# EAGLE design PCB-BO-HIROSE12 (EAGLE 7.1.0)
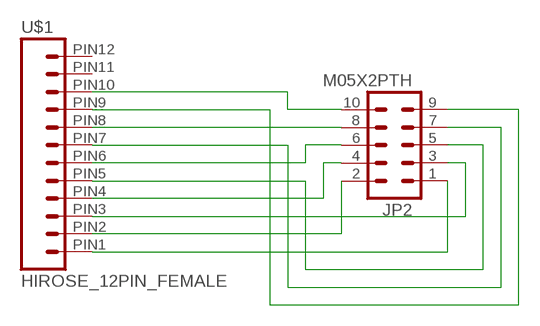
[diagram p0: schematic, sheet 1]

## Parts
JP2  M05X2PTH  [AVR_ICSP]
U$1  HIROSE_12PIN_FEMALE  [HIROSE_12PIN_RECEP]

## Nets
N$1: JP2.1 U$1.PIN1
N$2: JP2.2 U$1.PIN2
N$3 [power]: JP2.3 U$1.PIN3
N$4: JP2.4 U$1.PIN4
N$5: JP2.5 U$1.PIN5
N$6 [power]: JP2.6 U$1.PIN6
N$7: JP2.7 U$1.PIN7
N$8: JP2.8 U$1.PIN8
N$9: JP2.9 U$1.PIN9
N$10: JP2.10 U$1.PIN10
Unconnected: U$1.PIN11 U$1.PIN12

## Library data of the parts
JP2 = SKAARHOJ:M05X2: Header 5x2 Standard 10-pin dual row 0.1" header. Commonly used with AVR-ISP. Use with Spark Fun Electronics SKU: PRT-00778
U$1 = SKAARHOJ:HIROSE_12PIN_FEMALE

## Net classes
0 default: width 0.152 mm, clearance 0.152 mm
1 power: width 0.406 mm, clearance 0.152 mm

## Board
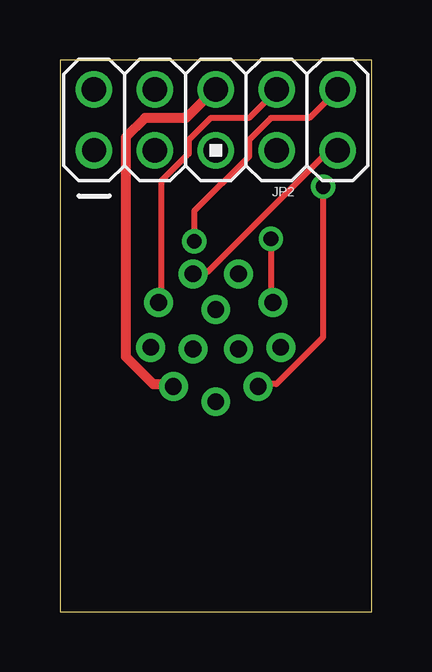
[diagram p1: board, top side]
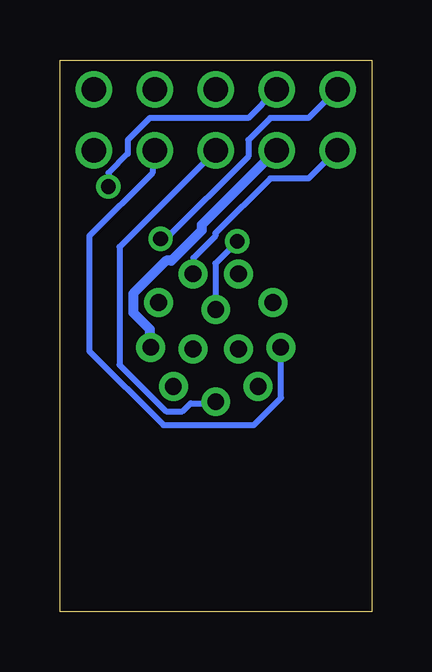
[diagram p2: board, bottom side, seen from below]

Size 13 x 23 mm. Coordinates in mm from the lower left corner, seen from the top.
Outline: 0,0 13,0 13,23 0,23 0,0
Copper layers (1*16): Top 0.035mm / dielectric 1.5mm / Bottom 0.035mm
Design rules "default": minimum track width 10mil, minimum drill 24mil, track to track 8mil, track to pad 8mil, pad to pad 8mil, via to via 8mil, smd to smd 8mil, copper to edge 40mil, drill to drill 8mil, minimum pad ring 10mil, minimum via ring 8mil, stop-mask expansion 4mil, vias tented up to drill 0mil, thermal gap 10mil

### Footprints (pad centres in the part's own frame; a part is rotated, then mirrored left to right if it is on the bottom)
AVR_ICSP = drill 1: 1 -1.27,5.08 | drill 1.016: 2 1.27,5.08; 3 -1.27,2.54; 4 1.27,2.54; 5 -1.27,0; 6 1.27,0; 7 -1.27,-2.54; 8 1.27,-2.54; 9 -1.27,-5.08; 10 1.27,-5.08
HIROSE_12PIN_RECEP = drill 0.7: PIN1 0.95,2.58; PIN2 2.38,1.38; PIN3 2.71,-0.48; PIN4 1.77,-2.11; PIN5 0,-2.75; PIN6 -1.77,-2.11; PIN7 -2.71,-0.48; PIN8 -2.38,1.38; PIN9 -0.95,2.58; PIN10 0,1.1; PIN11 0.95,-0.55; PIN12 -0.95,-0.55

### Placement (x,y rotation side)
JP2  6.5,20.5 90 top
U$1  6.5,11.5 0 top

### Tracks (layer width: path | path; a pad name or v marks a point on that pad's centre or on a via)
N$1
  Bottom 0.254: U$1.PIN1 7.43,14.17 7.43,14.74 6.51,15.66 6.51,15.77 4.23,18.06 2.63,18.06 1.49,19.2 JP2.1
N$2  (via drill 0.61)
  Top 0.254: v8.8,15.54 8.8,12.92 U$1.PIN2
  Bottom 0.254: v8.8,15.54 8.57,15.54 5.14,18.97 5.14,19.66 4.23,20.57 2.63,20.57 1.49,21.72 JP2.2
N$3
  Bottom 0.406: U$1.PIN3 9.26,11.09 9.26,11.77 9.94,12.46 9.94,13.26 8.57,14.63 8.34,14.63 7.09,15.89 7.09,16.12 4,19.2 JP2.3
N$4  (via drill 0.61)
  Top 0.254: v10.97,17.72 10.97,11.43 9.03,9.49 8.34,9.49 U$1.PIN4
  Bottom 0.254: v10.97,17.72 10.97,18.29 10.17,19.09 10.17,19.66 9.26,20.57 5.14,20.57 4,21.72 JP2.4
N$5
  Bottom 0.254: U$1.PIN5 6.51,8.69 7.54,8.69 7.89,8.34 8.57,8.34 10.52,10.29 10.52,15.2 6.51,19.2 JP2.5
N$6
  Top 0.406: U$1.PIN6 4.69,9.49 3.89,9.49 2.74,10.63 2.74,19.77 3.54,20.57 5.26,20.57 6.4,21.72 JP2.6
N$7
  Bottom 0.254: U$1.PIN7 3.77,10.97 3.77,8.91 4.92,7.77 8.69,7.77 11.77,10.86 11.77,15.66 9.14,18.29 9.14,19.2 JP2.7
N$8
  Top 0.254: U$1.PIN8 4.23,12.92 4.23,17.95 5.37,19.09 5.37,19.66 6.29,20.57 7.89,20.57 9.03,21.72 JP2.8
N$9
  Top 0.254: U$1.PIN9 5.6,14.17 6.17,14.17 11.2,19.2 11.54,19.2 JP2.9
N$10  (via drill 0.61)
  Top 0.254: v5.6,15.43 5.6,16.69 7.89,18.97 7.89,19.66 8.8,20.57 10.4,20.57 11.54,21.72 JP2.10
  Bottom 0.254: v5.6,15.43 6.51,14.52 6.51,12.69 U$1.PIN10